# EAGLE board SL869-GL868-Rx (EAGLE 6.5.0)
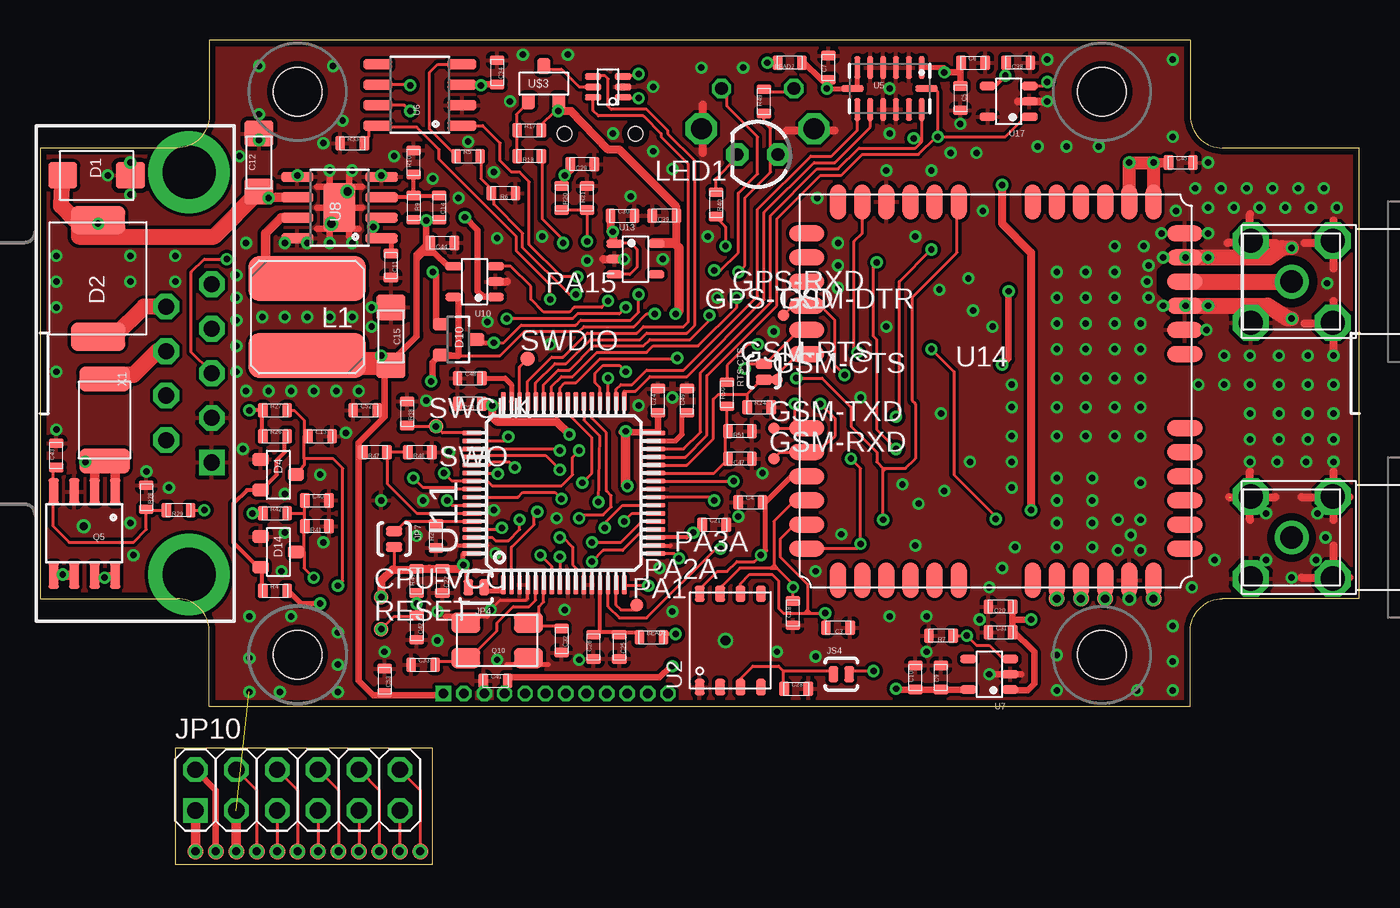
[diagram p1: board, top side]
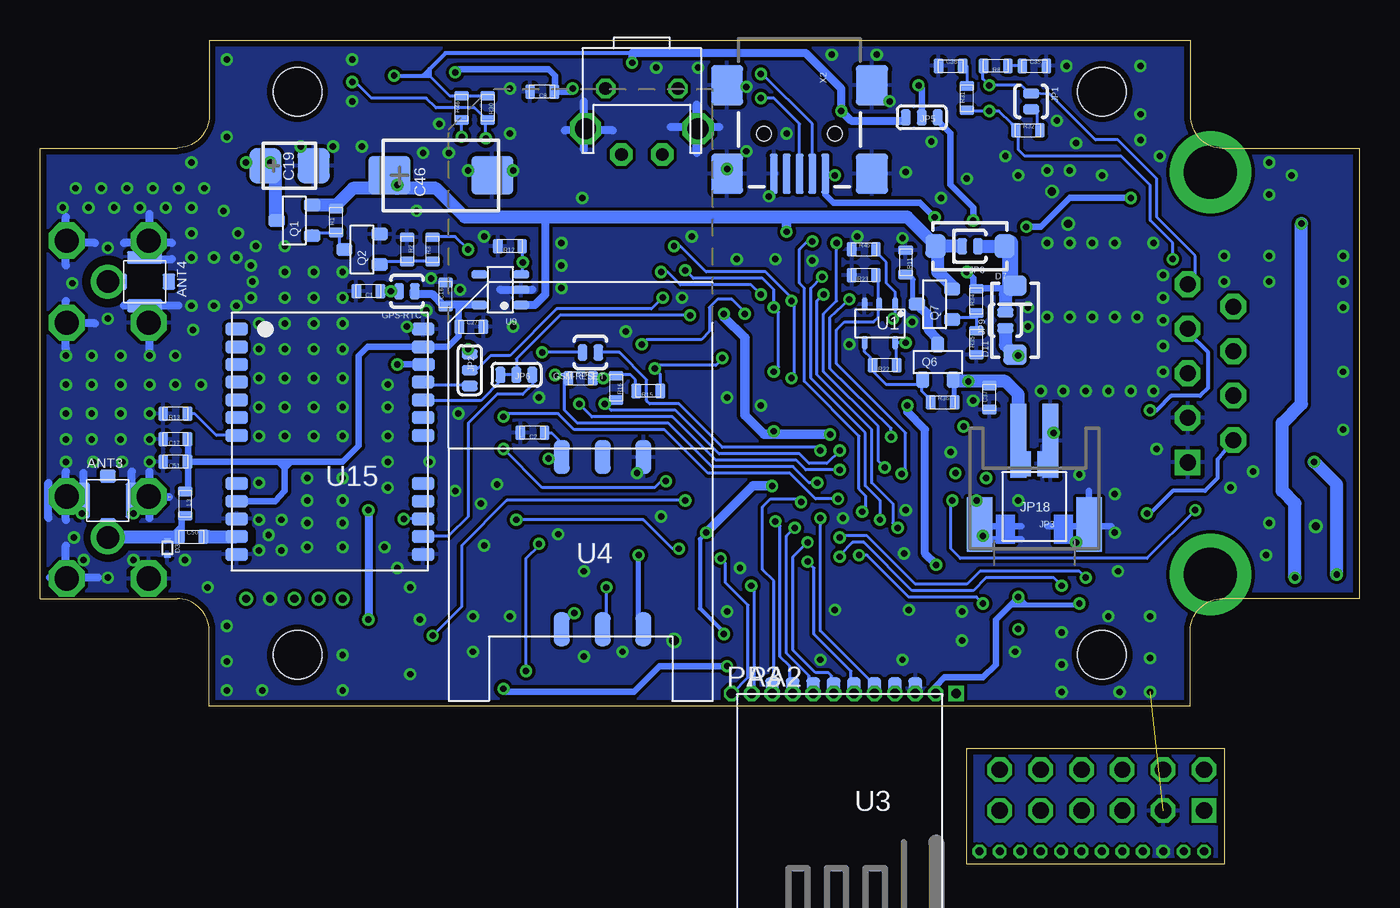
[diagram p2: board, bottom side, seen from below]

Size 82 x 51.2 mm. Coordinates in mm from the lower left corner, seen from the top.
Outline: 8.4,7.2 8.4,0 24.4,0 24.4,7.2 8.4,7.2
Copper layers (1*16): Top 0.0356mm / dielectric 1.5011mm / Bottom 0.0356mm
Design rules "OSHPark *": minimum track width 6mil, minimum drill 13mil, track to track 6mil, track to pad 6mil, pad to pad 6mil, via to via 6mil, smd to smd 6mil, copper to edge 15mil, drill to drill 6mil, minimum pad ring 7mil, minimum via ring 7mil, stop-mask expansion 3mil, vias tented up to drill 0.4mm, thermal gap 10mil
tRestrict: area 76.5,34.9 to 79.1,37.5; area 76.6,19.1 to 79,21.5; 6 lines
bRestrict: area 76.5,34.9 to 79.1,37.5; area 76.6,19.1 to 79,21.5; 6 lines

## Footprints (pad centres in the part's own frame; a part is rotated, then mirrored left to right if it is on the bottom)
SMA-002 = drill 1.4 pad 2: A 0,0 | drill 1.5 pad 2 octagon: GND@1 -2.55,2.55; GND@2 2.55,2.55; GND@3 2.55,-2.55; GND@4 -2.55,-2.55
MM9329 = smd 1 x 0.8: 1 0,-1.5; P$3 0,1.5 | smd 0.8 x 2.2: 2 -1.5,0; 2@1 1.5,0
0603 = smd 0.6 x 0.9: 1 -0.75,0; 2 0.75,0
1206 = smd 1.6 x 1.8: 1 -1.8,0; 2 1.8,0
CT3528 = smd 2 x 2.2: + -1.5,0; - 1.5,0
CT7343 = smd 2.6 x 2.4: + -3.2,0; - 3.2,0
TP09R = smd 0.9 x 0.9: TP 0,0
SMA = smd 1.8 x 1.65: P$1 2.1,0; P$2 -2.1,0
SMC = smd 1.75 x 3.4: P$1 3.625,0; P$2 -3.625,0
SOD-923 = smd 0.3 x 0.4: 1 -0.45,0; 2 0.45,0
SOT-23 = smd 0.8 x 1: 1 -0.95,-1.1; 2 0.95,-1.1; 3 0,1.1
SMA-DIODE = smd 1.27 x 1.47: A -2.15,0; C 2.15,0
SOT23 = smd 0.8 x 1: 1 -0.95,-1.1; 2 0.95,-1.1; 3 0,1.1
PAD.1X1 = smd 1 x 1: P$1 0,0
1812 = smd 1.58 x 3.15: 1 -2.55,0; 2 2.55,0
PAD.03X.03 = smd 0.762 x 0.762: P$1 0,0
SJ_2S-NO = smd 0.6 x 1: 1 -0.49,0; 2 0.49,0
TP07R = smd 0.7 x 0.7: TP 0,0
SJ_3 = smd 0.635 x 1: 1 -0.99,0; 2 0,0; 3 0.99,0
S2B-PH = smd 1 x 4.6: 1 -1,-3.7; 2 1,-3.7 | smd 1.6 x 3.4: NC1 -3.4,1.5; NC2 3.4,1.5
2X06 = drill 1.016 square: 1 -6.35,-1.27 | drill 1.016 octagon: 2 -6.35,1.27; 3 -3.81,-1.27; 4 -3.81,1.27; 5 -1.27,-1.27; 6 -1.27,1.27; 7 1.27,-1.27; 8 1.27,1.27; 9 3.81,-1.27; 10 3.81,1.27; 11 6.35,-1.27; 12 6.35,1.27
CI1102M1H = smd 0.6 x 1.55: 1 -0.5,4.775; 2 0.5,4.775
CDRH6D38NP = smd 7.3 x 2.8: P$1 0,-2.4; P$2 0,2.4
LED3MM = drill 0.8 pad 1.4 octagon: A -1.27,0; K 1.27,0
TP08R = smd 0.8 x 0.8: TP 0,0
SO08 = smd 0.65 x 1.7: 1 -1.905,-2.6; 2 -0.635,-2.6; 3 0.635,-2.6; 4 1.905,-2.6; 5 1.905,2.6; 6 0.635,2.6; 7 -0.635,2.6; 8 -1.905,2.6
KX-9A = smd 1.8 x 1.25: 1 -1.95,-1.1; 2 1.95,-1.1; 3 1.95,1.1; 4 -1.95,1.1
SWT-7 = drill 0.8 octagon: 1 -2.25,0; 2 2.25,0 | drill 1.3 octagon: G@1 -3.5,2.5; G@2 3.5,2.5
SOT-753 = smd 0.4 x 0.8: 1 -0.95,-1.2; 2 0.05,-1.2; 3 0.95,-1.2; 4 0.95,1.2; 5 -0.95,1.2
MFF2 = smd 1 x 0.6: 1 -2.9,1.905; 2 -2.9,0.635; 3 -2.9,-0.635; 4 -2.9,-1.905; 5 2.9,-1.905; 6 2.9,-0.635; 7 2.9,0.635; 8 2.9,1.905
RFM70S = smd 0.85 x 1.4: CE -2.16,-2; CSN -0.89,-2; GND -4.7,-2; IRQ 4.19,-2; MISO 2.92,-2; MOSI 1.65,-2; SCK 0.38,-2; VDD -3.43,-2
6393699-1 = smd 2.1 x 1: 1 0.75,-2.6; 2 0.75,-0.06; 3 0.75,2.48; 4 11.45,-2.6; 5 11.45,-0.06; 6 11.45,2.48
LGA14 = smd 0.4 x 1.4: 1 2,1.3; 2 1.2,1.3; 3 0.4,1.3; 4 -0.4,1.3; 5 -1.2,1.3; 6 -2,1.3; 8 -2,-1.3; 9 -1.2,-1.3; 10 -0.4,-1.3; 11 0.4,-1.3; 12 1.2,-1.3; 13 2,-1.3 | smd 1.4 x 0.4: 7 -2.3,0; 14 2.3,0
SO08' = smd 0.6 x 1.8: 1 -1.905,-2.616; 2 -0.635,-2.616; 3 0.635,-2.616; 4 1.905,-2.616; 5 1.905,2.616; 6 0.635,2.616; 7 -0.635,2.616; 8 -1.905,2.616
SOT23-5 = smd 0.5 x 1: 1 -0.95,-1.3; 2 0,-1.3; 3 0.95,-1.3; 4 0.95,1.3; 5 -0.95,1.3
SO08-EPAD = smd 0.6 x 2: 1 -1.905,-2.616; 2 -0.635,-2.616; 3 0.635,-2.616; 4 1.905,-2.616; 5 1.905,2.616; 6 0.635,2.616; 7 -0.635,2.616 | smd 0.61 x 2: 8 -1.905,2.616 | smd 3 x 2: EPAD 0,0
TQFP64 = smd 1.2 x 0.3: 1 -5.7,3.75; 2 -5.7,3.25; 3 -5.7,2.75; 4 -5.7,2.25; 5 -5.7,1.75; 6 -5.7,1.25; 7 -5.7,0.75; 8 -5.7,0.25; 9 -5.7,-0.25; 10 -5.7,-0.75; 11 -5.7,-1.25; 12 -5.7,-1.75; 13 -5.7,-2.25; 14 -5.7,-2.75; 15 -5.7,-3.25; 16 -5.7,-3.75; 33 5.7,-3.75; 34 5.7,-3.25; 35 5.7,-2.75; 36 5.7,-2.25; 37 5.7,-1.75; 38 5.7,-1.25; 39 5.7,-0.75; 40 5.7,-0.25; 41 5.7,0.25; 42 5.7,0.75; 43 5.7,1.25; 44 5.7,1.75; 45 5.7,2.25; 46 5.7,2.75; 47 5.7,3.25; 48 5.7,3.75 | smd 0.3 x 1.2: 17 -3.75,-5.7; 18 -3.25,-5.7; 19 -2.75,-5.7; 20 -2.25,-5.7; 21 -1.75,-5.7; 22 -1.25,-5.7; 23 -0.75,-5.7; 24 -0.25,-5.7; 25 0.25,-5.7; 26 0.75,-5.7; 27 1.25,-5.7; 28 1.75,-5.7; 29 2.25,-5.7; 30 2.75,-5.7; 31 3.25,-5.7; 32 3.75,-5.7; 49 3.75,5.7; 50 3.25,5.7; 51 2.75,5.7; 52 2.25,5.7; 53 1.75,5.7; 54 1.25,5.7; 55 0.75,5.7; 56 0.25,5.7; 57 -0.25,5.7; 58 -0.75,5.7; 59 -1.25,5.7; 60 -1.75,5.7; 61 -2.25,5.7; 62 -2.75,5.7; 63 -3.25,5.7; 64 -3.75,5.7
GL865/8-DUAL = smd 2.2 x 1: 1 -11.75,9.8; 2 -11.75,8.3; 3 -11.75,6.8; 4 -11.75,5.3; 5 -11.75,3.8; 6 -11.75,2.3; 7 -11.75,-2.3; 8 -11.75,-3.8; 9 -11.75,-5.3; 10 -11.75,-6.8; 11 -11.75,-8.3; 12 -11.75,-9.8; 25 11.75,-9.8; 26 11.75,-8.3; 27 11.75,-6.8; 28 11.75,-5.3; 29 11.75,-3.8; 30 11.75,-2.3; 31 11.75,2.3; 32 11.75,3.8; 33 11.75,5.3; 34 11.75,6.8; 35 11.75,8.3; 36 11.75,9.8 | smd 1 x 2.2: 13 -9.8,-11.75; 14 -8.3,-11.75; 15 -6.8,-11.75; 16 -5.3,-11.75; 17 -3.8,-11.75; 18 -2.3,-11.75; 19 2.3,-11.75; 20 3.8,-11.75; 21 5.3,-11.75; 22 6.8,-11.75; 23 8.3,-11.75; 24 9.8,-11.75; 37 9.8,11.75; 38 8.3,11.75; 39 6.8,11.75; 40 5.3,11.75; 41 3.8,11.75; 42 2.3,11.75; 43 -2.3,11.75; 44 -3.8,11.75; 45 -5.3,11.75; 46 -6.8,11.75; 47 -8.3,11.75; 48 -9.8,11.75
SL868/9 = smd 1.4 x 0.8: 1 5.8,-7; 2 5.8,-5.9; 3 5.8,-4.8; 4 5.8,-3.7; 5 5.8,-2.6; 6 5.8,-1.5; 7 5.8,-0.4; 8 5.8,2.6; 9 5.8,3.7; 10 5.8,4.8; 11 5.8,5.9; 12 5.8,7; 13 -5.8,7; 14 -5.8,5.9; 15 -5.8,4.8; 16 -5.8,3.7; 17 -5.8,2.6; 18 -5.8,-0.4; 19 -5.8,-1.5; 20 -5.8,-2.6; 21 -5.8,-3.7; 22 -5.83,-4.8; 23 -5.8,-5.9; 24 -5.8,-7
G403 = hole 3: 66,38.2; 66,3.2; 16,38.2; 16,3.2
SOT323-6 = smd 0.4 x 1.05: 1 -0.65,-0.925; 2 0,-0.925; 3 0.65,-0.925; 4 0.65,0.925; 5 0,0.925; 6 -0.65,0.925
DB9 = drill 1 pad 1.6 square: 1 -5.54,-1.42 | drill 1 pad 1.6 octagon: 2 -2.77,-1.42; 3 0,-1.42; 4 2.77,-1.42; 5 5.54,-1.42; 6 -4.15,1.42; 7 -1.38,1.42; 8 1.38,1.42; 9 4.15,1.42 | drill 3.302 pad 5.08: G1 -12.5,0; G2 12.5,0
USB-MINIB = smd 2.5 x 0.5: D+ 2.5,0; D- 2.5,0.8; GND 2.5,-1.6; ID 2.5,-0.8; VBUS 2.5,1.6 | smd 2.5 x 2: GND@1 -3,-4.5; GND@2 -3,4.5; GND@3 2.5,4.5; GND@4 2.5,-4.5 | hole 0.9: 0,2.2; 0,-2.2

## Placement (x,y rotation side)
ANT1  SMA-002  [SMA-002]  77.8,20.3 90 top
ANT2  SMA-002  [SMA-002]  77.8,36.2 90 top
ANT3  SMA-002  [MM9329]  77.8,22.6 0 bottom
ANT4  IPF  [MM9329]  75.5,36.2 270 bottom
BEAD1  FB600  [0603]  38,14.1 0 top
BEAD2  FB600  [0603]  46.6,49.8 180 top
C1  2.2u  [0603]  61.6,35.6 180 bottom
C2  22p  [0603]  51.4,26.8 180 bottom
C3  22p  [0603]  49.6,14.7 180 top
C4  10n  [0603]  44.15,22.5 0 top
C5  10u  [0603]  57.2,47.6 270 top
C6  0.1u  [0603]  58,49.8 0 top
C7  10u  [0603]  49,49.5 90 top
C8  0.1u  [0603]  50.8,48 180 bottom
C9  4.7u  [0603]  56,11.6 90 top
C10  0.1u  [0603]  54.4,11.6 90 top
C11  0.1u/50  [0603]  21.8,37.2 270 top
C12  10u/50  [1206]  13.6,43.6 90 top
C13  0.1u  [0603]  17.4,26.6 0 top
C14  4n7  [0603]  24.8,40.8 270 top
C15  22x10  [1206]  21.8,32.8 270 top
C16  10u  [0603]  56.8,35.4 90 bottom
C17  0.1u  [0603]  73.6,26.4 180 bottom
C18  22p  [0603]  46.8,15.6 90 top
C19  22x6.3  [CT3528]  66.5,43.4 0 bottom
C20  4.7u  [0603]  59.7,16 180 top
C21  0.1u  [0603]  41.9,21.1 0 top
C22  0.1u  [0603]  25,17.6 270 top
C23  0.1u  [0603]  26.7,28.6 180 top
C24  0.1u  [0603]  38.4,28.8 90 top
C25  2.2u  [0603]  36,13.5 270 top
C26  0.1u  [0603]  34.4,13.5 90 top
C27  0.1u  [0603]  55.2,33.4 0 bottom
C28  22p  [0603]  47,10.9 0 top
C29  4.7u  [0603]  33.7,43.5 180 top
C30  4.7u  [0603]  36.2,40.3 0 top
C31  0.1u  [0603]  59.7,14.4 0 top
C32  15p  [0603]  32.4,13.9 270 top
C33  15p  [0603]  23.8,12.4 0 top
C34  4.7u  [0603]  28.4,49.2 270 top
C35  560p  [0603]  20.2,49.6 0 bottom
C36  560p  [0603]  25.4,49.6 0 bottom
C37  4.7u  [0603]  23,29 90 bottom
C38  0.1u  [0603]  60.8,49.8 180 top
C39  4.7u  [0603]  38.8,40.3 180 top
C40  0.1u  [0603]  17.2,22.6 0 top
C41  0.1u  [0603]  28.3,11.4 0 top
C42  0.1u  [0603]  23.4,14.7 270 top
C43  0.1u  [0603]  1,25.4 90 top
C44  0.1u  [0603]  25,38.6 180 top
C45  0.1u  [0603]  70.9,43.6 0 top
C46  220x6.3  [CT7343]  57.1,42.8 0 bottom
C47  0.1u  [0603]  43.5,25.2 180 top
C48  2u2  [0603]  26.7,30.2 0 top
C49  2u2  [0603]  40.2,28.8 90 top
C50  27p  [0603]  72.6,20.35 0 bottom
C51  27p  [0603]  73.6,25 180 bottom
C52  0.1u  [0603]  20.2,28.2 0 top
C53  0.1u  [0603]  21.4,11.4 270 top
CPU-VCC  TPTP09R  [TP09R]  21.2,16.6 0 top
D1  SMAJ24CA  [SMA]  3.5,42.8 180 top
D2  MBRS360T3G  [SMC]  3.6,36.4 90 top
D3  ESD9R3.3S  [SOD-923]  74.1,19.65 270 bottom
D4  BAV99  [SOT-23]  14.8,24.2 270 top
D7  SS14/SS24  [SMA-DIODE]  24.2,38.4 180 bottom
D10  BAT54C  [SOT23]  26,32.6 270 top
D11  SS24  [SMA-DIODE]  21.4,33.8 90 bottom
D14  BAV99  [SOT-23]  14.8,19.4 270 top
EX1  [PAD.1X1]  9.65,0.79 0 top
EX2  [PAD.1X1]  10.92,0.79 0 top
EX3  [PAD.1X1]  12.19,0.79 0 top
EX4  [PAD.1X1]  13.46,0.79 0 top
EX5  [PAD.1X1]  14.73,0.79 0 top
EX6  [PAD.1X1]  16,0.79 0 top
EX7  [PAD.1X1]  17.27,0.79 0 top
EX8  [PAD.1X1]  18.54,0.79 0 top
EX9  [PAD.1X1]  19.81,0.79 0 top
EX10  [PAD.1X1]  21.08,0.79 0 top
EX11  [PAD.1X1]  22.35,0.79 0 top
EX12  [PAD.1X1]  23.62,0.79 0 top
F1  1.5A  [1812]  4,27.6 90 top
GND  [PAD.03X.03]  21.2,22.6 0 top
GPS-RTC  GPS-RTC  [SJ_2S-NO]  59.2,35.6 180 bottom
GPS-RXD  TPTP07R  [TP07R]  43.3,35.2 0 top
GPS-TXD  TPTP07R  [TP07R]  41.6,34.1 0 top
GSM-CTS  TPTP07R  [TP07R]  45.8,30.1 0 top
GSM-DTR  TPTP07R  [TP07R]  46.2,34.1 0 top
GSM-RESET  RTS-CTS  [SJ_2S-NO]  47.8,31.8 180 bottom
GSM-RTS  TPTP07R  [TP07R]  43.8,30.8 0 top
GSM-RXD  TPTP07R  [TP07R]  45.6,25.2 0 top
GSM-TXD  TPTP07R  [TP07R]  45.6,27.1 0 top
JP1  CAN-TERM  [SJ_2S-NO]  20.4,47.4 270 bottom
JP2  RX-SEL  [SJ_3]  55.3,30.7 270 bottom
JP3  BAT2  [S2B-PH]  20.2,22.6 180 bottom
JP4  VBAT  [SJ_2S-NO]  27.1,17.2 180 top
JP5  CANPWR-SEL  [SJ_3]  27.2,46.4 180 bottom
JP6  TX-SEL  [SJ_3]  52.4,30.4 180 bottom
JP7  BOOT0  [SJ_2S-NO]  22,20.2 270 top
JP8  [SJ_2S-NO]  24.2,38.4 180 bottom
JP9  [SJ_2S-NO]  22,33.8 90 bottom
JP10  [2X06]  16,4.6 0 top
JP18  BAT1  [CI1102M1H]  20.2,20.1 0 bottom
JS4  USE-SOC  [SJ_2S-NO]  49.8,11.8 0 top
L1  3R3  [CDRH6D38NP]  16.6,34 180 top
L3  27nH  [0603]  73,22.4 270 bottom
LED1  STATUS  [LED3MM]  44.6,44.1 180 top
MICN  [PAD.1X1]  66.2,16.5 0 top
MICP  [PAD.1X1]  69.2,16.5 0 top
PA1  TPTP08R  [TP08R]  37.1,16.1 0 top
PA2  TPTP08R  [TP08R]  37.76,10.6 0 bottom
PA2A  TPTP07R  [TP07R]  37.8,17.3 0 top
PA3  TPTP08R  [TP08R]  39.03,10.6 0 bottom
PA3A  TPTP07R  [TP07R]  39.7,19 0 top
PA15  TPTP07R  [TP07R]  31.7,35.1 0 top
PB4  TEST-POINT3  [PAD.03X.03]  23.2,24 0 top
Q1  IRLML6402  [SOT-23]  66.2,40 90 bottom
Q2  BC847/BSS138  [SOT-23]  62,38.2 90 bottom
Q5  IRF7353D2  [SO08]  2.75,20.55 180 top
Q6  IRLML6401  [SOT-23]  26.2,31.2 0 bottom
Q7  IRLML6401  [SOT-23]  26.4,34.8 90 bottom
Q10  8MHz  [KX-9A]  28.4,13.9 180 top
R1  100K  [0603]  63.6,40 90 bottom
R2  22K  [0603]  59.2,38.2 270 bottom
R3  2K2  [0603]  57.6,38.2 90 bottom
R4  10  [0603]  14.6,17 0 top
R5  1K  [0603]  26.6,44 0 top
R6  2K2  [0603]  28.8,41.7 180 top
R7  22K  [0603]  56,14.2 180 top
R8  100  [0603]  22.6,49.6 180 bottom
R9  82.5K  [0603]  23.2,40.8 270 top
R10  20K  [0603]  23.2,43.6 90 top
R11  1M  [0603]  28.2,37.4 270 bottom
R12  22K  [0603]  52.8,38.4 180 bottom
R13  DNP/100K  [0603]  73.6,28 180 bottom
R14  47K  [0603]  48.4,30.2 0 bottom
R15  47K  [0603]  44.2,29.4 180 bottom
R16  47K  [0603]  46.2,29.6 270 bottom
R17  47K  [0603]  30.4,45.6 0 top
R18  10K  [0603]  30.4,44 180 top
R20  22K  [0603]  32.4,41.4 270 top
R21  22K  [0603]  34,41.4 90 top
R22  100K  [0603]  29.5,31 180 bottom
R23  100K  [0603]  30.8,36.6 180 bottom
R24  100K  [0603]  44.7,28.4 0 top
R25  100K  [0603]  24.6,20.4 90 top
R26  100K  [0603]  14.6,26.6 0 top
R27  100K  [0603]  14.6,28.2 0 top
R28  22K  [0603]  6.6,22.8 270 top
R29  470  [0603]  8.6,22 180 top
R30  10K  [0603]  54.2,47 270 bottom
R31  100  [0603]  24.4,47.6 90 bottom
R32  120  [0603]  20.6,45.6 0 bottom
R33  10K/4K7  [0603]  19.4,44.8 0 top
R34  10K  [0603]  23.8,35 90 bottom
R35  100K  [0603]  23.8,32.4 90 bottom
R36  100K  [0603]  25.9,28.7 0 bottom
R38  100K  [0603]  22.8,28 270 top
R40  470  [0603]  42,41 270 top
R41  22K  [0603]  17.2,21 180 top
R42  100K  [0603]  14.6,21.8 0 top
R43  22K  [0603]  23.4,17.6 90 top
R45  100K  [0603]  30.8,38.2 0 bottom
R46  10K  [0603]  55.8,47 90 bottom
R47  100K  [0603]  20.8,25.6 180 top
R48  100K  [0603]  23.6,25.6 180 top
R49  10K  [0603]  45,47.4 90 top
R50  100K  [0603]  42.7,29.2 90 top
R51  100K  [0603]  43.5,26.9 180 top
RESET  TPTP09R  [TP09R]  21.2,14.6 0 top
RTS-CTS  RTS-CTS  [SJ_2S-NO]  45,30.6 90 top
SPKM  [PAD.1X1]  63.2,16.5 0 top
SPKP  [PAD.1X1]  64.7,16.5 0 top
SW1  SWT7  [SWT-7]  44.6,48.2 180 bottom
SWCLK  TPTP09R  [TP09R]  24.6,27.2 0 top
SWDIO  TPTP09R  [TP09R]  30.3,31.4 0 top
SWO  TPTP07R  [TP07R]  25.1,24.3 0 top
U1  74LVC1G02GV  [SOT-753]  29.8,33.6 180 bottom
U2  SIMHOLDER-MFF2  [MFF2]  42.9,13.9 90 top
U3  RFM70S  [RFM70S]  32.3,8.9 180 bottom
U4  SIMHOLDER-6393699  [6393699-1]  47.1,13.85 90 bottom
U5  MMA7455L  [LGA14]  52.8,48.2 0 top
U6  MCP2551  [SO08']  23.6,47.8 90 top
U7  AAT3221IGV-3.3-T1  [SOT23-5]  59,11.8 90 top
U8  ST1S10-SO8PAD  [SO08-EPAD]  18.6,40.8 90 top
U9  LP3985IM5-3.0  [SOT23-5]  53.4,35.7 90 bottom
U10  MAX1555  [SOT23-5]  27,36.2 90 top
U11  STM32F103RBT6  [TQFP64]  32.55,23.05 90 top
U13  MP8802DJ-3.3-LF  [SOT23-5]  37,37.6 270 top
U14  GL865/8-DUAL  [GL865/8-DUAL]  59.4,29.4 0 top
U15  SL868/9  [SL868/9]  64,26.25 180 bottom
U17  24LC16B-I/OT  [SOT23-5]  60.2,47.4 90 top
U$1  [G403]  0,9.8 0 top
U$3  PDTA114ET  [SOT-23]  31.3,48.5 0 top
U$4  USBUF02W6  [SOT323-6]  35.3,48.3 90 top
X1  DB-9  [DB9]  9.25,30.5 90 top
X2  USB-SMD  [USB-MINIB]  34.8,45.4 270 bottom

## Tracks (layer width: path | path; a pad name or v marks a point on that pad's centre or on a via)
+5V  (via drill 0.4)
  Top 0.2: v32.6,42.8 32.4,42.6 R20.1
  Top 0.4: U10.1 27.55,35.25 27.2,35.6 27.2,39.4 v26.4,40.2
  Top 0.5: C29.2 32.95,43.15 v32.6,42.8
  Bottom 0.4: 33.2,42.8 v32.6,42.8 | 33.2,42.8 33.2,41.6 32.7,41.1 27.3,41.1 v26.4,40.2 | 33.2,42.8 X2.VBUS
+12-IN
  Top 0.8: 3.62,32.62 3.6,32.6 D2.P$2
  Top 1: X1.9 6.45,34.65 4.6,32.8 3.62,32.8 D2.P$2
+12V  (via drill 0.4)
  Top 0.3: C11.1 21.8,38.89 U8.1
  Top 0.4: U8.2 20.7,40.16 v20.7,39.6 20.7,38.89 U8.1
  Top 0.5: Q5.7 3.45,17.75 v4,17.8 4.55,17.95 Q5.8 | v3.6,39.8 D2.P$1
  Top 0.6: U8.6 14.63,41.44 v14.2,41.4
  Top 0.65: C12.1 v14.2,41.4
  Top 1: C12.1 10.8,39 2.4,39 2.4,39.67 3.65,39.67 D2.P$1 2.17,40.03 1.3,40.9 D1.P$1
  Bottom 0.4: v14.2,41.4 18,41.4 19.8,39.6 v20.7,39.6
  Bottom 0.8: v4,17.8 4,22.4 4.8,23.2 4.8,27.4 3.6,28.6 v3.6,39.8
A1  (via drill 0.4)
  Top 0.25: v13.2,21.8 R42.1
  Bottom 0.25: X1.6 8.8,25.13 8.8,24 9.6,23.2 11.6,23.2 13,21.8 v13.2,21.8
ACC-VCC  (via drill 0.4)
  Top 0.3: U5.6 50.8,48.2 U5.7 49,48.2 | U5.1 56.2,49.5 v56.2,49.2 | 48.84,48.7 C7.1 49,48.2 | 49,48.2 v48.9,48.2
  Top 0.4: 48.84,48.7 48.6,48.7 47.4,49.9 47.4,50 BEAD2.1 | C6.1 57.2,50 57.2,49.2 | 57.2,49.2 C5.1 | v56.2,49.2 57.2,49.2
  Bottom 0.4: v56.2,49.2 56,49.4 50.4,49.4 50,49 50,48.05 C8.1 49.1,48 v48.9,48.2
CANH  (via drill 0.4)
  Top 0.2: U6.7 22.64,47.17 v23,46.8 | X1.3 10.55,30.65 9.4,31.8 9.4,36.8 10.2,37.6 v11.6,37.6
  Bottom 0.2: v11.6,37.6 11.6,38.6 13,40 13,42.2 14.8,44 20.8,44 21.2,44.4 21.2,45.47 R32.1 21.6,46 22.4,46.8 v23,46.8 23.88,46.8 R31.1
  Bottom 0.25: R32.1 21.48,45.45
CANL  (via drill 0.4)
  Top 0.2: U6.6 22.96,48.44 v23,48.4
  Bottom 0.2: X1.5 10.59,36.19 10.2,36.6 10.2,37.8 12.6,40.2 12.6,42.6 15,45 16.4,45 19.25,47.85 JP1.1 | 20.41,47.81 21,48.4 v23,48.4 23.4,48.8 23.4,49.54 R8.2
  Bottom 0.25: JP1.1 20.41,47.83 20.41,47.81 20.4,47.8
CPU-VBAT
  Top 0.2: 28.8,17 U11.1
  Top 0.3: 28.8,17 27.55,17 JP4.1
CPU-VCC  (via drill 0.4, 0.6)
  Top 0.2: v60,49 60.05,49.05 | JP7.2 22,18.4 21.9,18.3 | R17.2 31.15,45.95 32,46.8 v32.2,46.8
  Top 0.25: U11.19 40.2,20.3 40.5,20.6 v40.6,20.6 | BEAD1.2 38.96,14.26 38.8,14.3 v39.5,14.3 | 26.3,19.3 U11.64 | U11.48 28.8,28.6 28.1,28.6 v28.1,28.5 | U17.4 59.35,48.35 v60,49 | 60.05,49.05 C38.2
  Top 0.3: v40.6,20.6 40.8,20.6 C21.1 | v26.3,18.6 26.3,19.3 | v45.2,49.8 BEAD2.2 | R4.2 15.4,17 16.2,16.2 v17.4,16.2 | 23.34,18.3 R43.2 | JP4.2 26.65,17.35 26.5,17.5 26.5,18.6 v26.3,18.6 | v26.3,18.6 26.2,18.6 | U11.32 38.1,26.8 38.4,26.85
  Top 0.4: v36.4,26.9 36.15,26.85 38.4,26.85 C24.1
  Top 0.5: 28.1,28.6 C23.1 | 38.1,38.6 U13.5 | U13.5 38.16,38.55 | v28.1,28.5 28.1,27.8 28.4,27.5 32.1,27.5 v32.9,26.7 | 23.34,18.3 21.9,18.3 21.2,17.6 CPU-VCC.TP | R43.2 24.2,18.36 C22.1 26,18.35 26.2,18.6 26.26,18.56 v26.3,18.6 | U$3.2 32.25,46.65 v32.2,46.8 33,46.8 35.3,44.4 36,44.4 39.55,40.85 C39.1 39.55,38.55 U13.5
  Top 0.6: v36.4,26.9 36.4,23.5 v36.5,23.5 | 38.1,38.6 39.4,38.6 39.7,38.3 39.7,34.4 v39.5,34.2
  Bottom 0.2: R30.1 R46.2 56.56,47.76 57.8,49
  Bottom 0.25: v39.5,14.3 39.6,14.5 41,15.9 41,20.2 v40.6,20.6 | 45.2,50.4 56.8,50.4 57.8,49.4 | 57.8,49.4 57.8,49 58.2,49 | v60,49 58.2,49 | 57.8,49.4 58.2,49
  Bottom 0.3: v17.4,16.2 17.5,16.1 20.7,16.1 | 20.7,16.1 CPU-VCC.TP | 20.7,16.1 21.7,16.1
  Bottom 0.4: 28.2,46.2 28.2,46.29 JP5.3 | CPU-VCC.TP 21.7,16.1 22.6,15.2 22.6,12.4 23.4,11.6 25.8,11.6 26.33,11.07 v26.33,10.6
  Bottom 0.5: v45.2,49.8 45.2,50.4 34.4,50.4 32.2,48.2 v32.2,46.8 31.6,46.2 28.39,46.2 JP5.3 | v28.1,28.5 28.1,28.1 27,27 27,19.3 v26.3,18.6
  Bottom 0.6: v36.5,23.5 37.7,23.5 v40.6,20.6 | 36.4,26.7 37,26.7 38.2,27.9 38.2,32.7 39.5,34 v39.5,34.2 | v32.9,26.7 36.4,26.7 | 36.4,26.7 v36.4,26.9
  other vias: 21.2,16.6
D1  (via drill 0.4)
  Top 0.25: v13,28.2 R27.1 13.8,28.15 13.8,26.8 R26.1
  Bottom 0.25: X1.4 10.62,33.02 9.4,31.8 9.4,29.6 9.9,29.1 11.7,29.1 12.6,28.2 v13,28.2
D+
  Top 0.2: U11.45 30.3,30 31.8,31.5 32.5,31.5 34,33 37.1,33 37.5,33.4 40,33.4 40.3,33.7 40.3,43.5 38.6,45.2 38.6,45.4 37.5,46.5 34.7,46.5 34.38,46.83 U$4.6
D-
  Top 0.2: U11.44 30.8,29.9 32,31.1 32.7,31.1 34.2,32.6 37.3,32.6 37.7,33 40.2,33 40.7,33.5 40.7,43.7 39,45.4 39,45.6 37.7,46.9 35.5,46.9 35.3,47.1 35.3,48.8 35.1,49 34.38,49 U$4.4
GND  (via drill 0.4, 0.5, 0.6)  (2 unrouted)
  Top 0.2: 30.3,17.4 30.3,16.5 30.2,16.4 28.6,16.4 v28,15.8
  Top 0.25: 37.4,19.8 39.2,19.8 | 27.8,19.8 25.9,19.8
  Top 0.3: 31.6,12.4 29,12.4 | 27.8,15.4 25.2,15.4
  Top 0.4: 59.2,11.8 61,11.8 | 17.2,40.8 20,40.8 | 18,39 18,42.8 | 19.2,39 19.2,42.8 | 17.2,39.5 19.8,39.5 | 17.2,42.1 20,42.1
  Top 0.5: 28.2,36.2 29,36.2 | 35,37.6 v36.3,37.6 | 75.2,38.6 73.8,38.6 | 75.2,38.6 76.8,38.6 | 78.6,38.6 81.2,38.6 | 78.6,33.6 81.2,33.6 | 80.4,37 80.4,40 | 75.2,38.6 75.2,40.4 | 80.4,32 80.4,35 | 78.4,22.8 81.4,22.8 | 75.2,21.4 75.2,24.4 | 73.9,22.8 76.8,22.8 | 80.4,21.4 80.4,24.4 | 80.4,17 80.4,19.8 | 78.4,17.8 81.4,17.8 | 41.2,44.2 41.2,47.2 | 46.4,45.6 49.4,45.6 | 60.8,47.4 v62.6,47.4
  Top 0.6: JP10.3 EX3.P$1
  Top 0.9: 77.2,38.3 v77.8,38.3 | 77.6,33.9 v77.8,33.9
  Top 1: 71.1,37.7 76.4,37.7 77.2,38.3 | 71.6,34.7 76.3,34.7 77.6,33.9
  Bottom 0.2: 76.8,34.7 76.6,34.8 | 75.2,37.6 ANT4.2 | U4.4 44.9,25.3 v44.9,24.3
  Bottom 0.3: JP3.1 19.2,26.18 JP18.2
  Bottom 0.4: 16.8,19.6 16.8,23.2 | 15.4,21 19.4,21 | 23.4,21 23.4,22.4 | 23.4,21 v23.4,20.4 | 21,21 23.4,21 | 21,20.2 23.8,20.2 v23.8,22.6
  Bottom 0.5: 75.2,37.6 75.2,40.4 | 73.8,38.6 76.8,38.6 | 80.4,37.2 80.4,40.2 | 78.6,38.6 81.2,38.6 | 80.4,32 80.4,35 | 78.6,33.6 81.2,33.6 | 80.4,21.4 80.4,24.4 | 80.4,17.2 80.4,19.8 | 78.4,17.8 81.4,17.8 | 74,22.8 76.2,22.8 | 75.2,21.5 75.2,24.4 | ANT3.2 81.5,22.6 | 41.2,44.2 41.2,47.2 | 39.8,45.8 42.8,45.8 | 46.4,45.6 49.4,45.6 | 48.2,44.4 48.2,47.4 | 75.2,31.8 75.2,34.7 | 73.4,34.7 76.8,34.7 | 75.2,37.6 73.8,37.6 | 75.2,37.6 76.2,37.6 | 76.3,21.7 76.3,24.4 | 79.3,21.7 ANT3.2 | ANT3.2 79.3,24.3 | 53.4,35.7 51.4,35.7 | 81.5,21.5 81.5,22.6 | 81.5,22.6 81.5,23.7
  other vias: 17.6,44.8 13.6,45 12.4,44 4.2,42.8 5.6,43.6 5.6,41.6 19.1,41.8 18.1,39.8 12.2,33.8 13.8,34 15.2,34 16.6,34 5.6,36.2 8.4,36.2 5.6,37.8 1,37.8 1,34.6 1,30.6 1,27 2.7,21 12.8,38.6 13,15.4 5.8,19.2 18.2,49.6 13.6,49.6 16.6,38.6 16,42.8 21.2,42.8 70.4,50 5.6,21.2 52.8,15.4 59,11.8 54.6,22.4 27.6,10.6 14.2,29.4 19.8,29.4 19.4,38.6 36.7,41.5 20.6,34.6 32.6,15.8 33.5,12.7 24,28.8 19,26.8 63.2,13 65.4,21.2 63.2,22.6 68.4,21.4 68.4,23.7 68.4,26.6 66.8,28.4 63.2,26.6 53.6,23.6 62,44.6 72.6,39.2 72.5,33.2 80,36.1 76.2,21.8 79.9,20.3 77.8,17.8 70.4,10.8 58.4,15.2 55.1,15.4 37.2,28.5 32.1,21.5 24.4,42.6 22,44 30,50.3 28.4,38.9 72.6,37.7 72.6,34.7 48.2,12.9 38.5,18.4 31.2,39 18.4,29.4 28.2,22 17,29.4 15.6,29.4 17.4,24.2 17.6,20 21.2,22.6 12.8,29.4 42.1,35.2 41.1,49.5 38.7,37.6 41.5,39 48.3,41.4 42.6,13.9 69.7,39.2 74.2,40.8 52.8,48.2 57.2,46 62.6,50 72.6,43.6 70.4,45.2 63.8,44.6 68.4,30.2 73.6,31.6 75.2,31.6 77,31.6 78.8,31.6 80.4,31.6 75.2,25 76.9,25 78.7,25 80.4,25 75.2,26.4 75.2,28 79.4,21.8 79.3,18.9 76.2,18.9 73,18.9 67,21.4 24.7,13.9 28.4,12.7 65.8,44.6 80.6,40.8 79,40.8 77.4,40.8 75.8,40.8 18,34 19.4,34 12.2,30.6 12.2,36.6 12.2,35.2 12.2,32.2 27.8,33.7 63.2,10.8 67.7,16.5 68.2,10.8 70.4,14.8 70.4,12.6 15.2,20.6 39.3,15.7 52.8,45.4 39.3,43.2 18.5,14.4 18.5,12.4 13,12.8 15.6,15.4 18.5,10.7 13,10.7 68.8,36.2 63.2,24 25.4,25.6 38.1,44.3 54.4,19.8 39.3,29 59,17.2 71.6,17.2 43.4,21.6 48.2,18.2 49.6,37.2 51,29 65,35.2 52.6,43.1 63.2,36.8 63.2,30.2 63.2,33.6 63.2,35.2 60.4,23.4 63.2,32 63.2,28.4 66.8,26.6 66.8,30.2 68.4,28.4 6.6,24.4 26.6,44.9 38.1,48.3 52.6,33.4 29.2,47.4 32.8,50.3 35.6,45.4 56,28 65,33.6 65,32 65,30.2 65,28.4 65,26.6 55.4,43.1 56.6,44.2 58,34.4 65.4,24 65.4,19.7 67,19.5 68.4,19.5 63.2,19.7 63.2,21.2 60.6,19.7 68.4,32 66.8,32 73.6,29.8 75.2,29.8 68.9,35.2 14.9,10.7 65.4,22.6 70.6,40.6 72.6,40.8 21.4,13.2 45.8,13.2 28.2,43 18,38.6 19.4,43.1 18,43.1 15.2,38.6 1,36.2 8.4,37.8 55.1,13.2 57.7,36.4 55.9,35.7 49.8,20.5 58.2,44.2 43.7,49.5 54.4,39 58.6,40.6 68.9,37.2 65,36.8 66.8,33.6 68.4,33.6 66.8,35.2 66.8,36.8 66.8,38.4 68.6,38.4 71.2,34.7 71.2,37.7 69.8,34.7 69.8,37.7 79.8,42 78.2,42 76.6,42 75,42 73.4,42 71.8,42 20.6,33.4 56.2,23.2 77,29.8 77,28 77,26.4 59.2,33.4 60.4,25 60.4,26.6 60.4,28.4 57.8,25 72,29.8 78.8,29.8 80.4,29.8 80.4,28 78.8,28 78.8,26.4 80.4,26.4 12.6,25.8 8,23.4 31.7,32.3 15.2,23 15,18.2 28.3,19.3 45.6,33.1 59.8,18.4 26,41.4 18.8,46.2 13.6,46.6 49.6,35.8 49.6,38.6 24.7,15.7 67.8,20.45 60.4,29.8 12.19,0.79 34,37.5
  pour Top (isolate 0.2, rank 6): 10.55,9.8 10.55,16.55 0.05,16.55 0.05,44.45 9.05,44.45 10.6,46 10.55,51.2 71.45,51.2 71.45,45.55 72.6,44.4 81.95,44.45 81.95,16.55 72.8,16.6 71.45,15.25 71.45,9.8
  pour Bottom (isolate 0.2, rank 6): 10.55,9.8 10.55,16.55 0.05,16.55 0.05,44.45 9.05,44.45 10.6,46 10.55,51.2 71.45,51.2 71.45,45.55 72.6,44.4 81.95,44.45 81.95,16.55 72.8,16.6 71.45,15.25 71.45,9.8
  pour Bottom: 8.4,7.2 8.4,0 24.4,0 24.4,7.2
GPS-RX0  (via drill 0.4)
  Top 0.2: v55.4,32 56.8,30.6 56.8,24.2 59.4,21.6 v59.4,21.45
  Bottom 0.2: JP2.1 55.31,31.89 v55.4,32 | U15.15 v59.4,21.45
GPS-RX1
  Bottom 0.2: U15.21 57.85,29.95 57.8,29.8 55.4,29.8 55.4,29.81 JP2.3
GPS-TX0
  Bottom 0.2: JP6.1 51.41,29.79 52,29.2 53.6,29.2 55.4,27.4 55.4,21.6 56.6,20.4 58.6,20.4 58.65,20.35 U15.14
GPS-TX1
  Bottom 0.2: JP6.3 53.19,30.01 53.2,30 53.4,30 54.6,28.8 57.8,28.8 57.95,28.85 U15.20
GPS-VCC
  Bottom 0.4: U15.9 67.4,22.55 66.8,23.2 66.8,24.6 | C17.1 72.8,26.4 72.8,25 | C51.1 72.8,25 | 72.8,25 72.8,23.2 L3.1 | 72.8,25 67.2,25 | 67.2,25 66.8,25 | 66.8,25 66.8,24.6 | C16.1 56.8,34.75 | 56,34.75 56,33.4 C27.1 56,33.35 56,32.8 56.65,32.15 U15.23 61.65,32.15 62.2,31.6 62.2,26 63.2,25 66.4,25 | 66.8,25 66.4,25 | 66.8,24.6 66.4,25 | 66.8,24.6 67.2,25
  Bottom 0.5: U9.5 56,34.75 56.8,34.75 | C16.1 56.85,34.65 57.6,35.4 58.8,35.4 58.8,35.6 GPS-RTC.1
GSM-ANT
  Top 1: U14.34 ANT2.A
  Bottom 0.2: ANT2.A ANT4.1
GSM-RESET  (via drill 0.4)
  Top 0.2: v50.8,31.8 50.6,32 50.6,38.7 51.1,39.2 U14.47 51.1,41.2
  Bottom 0.2: GSM-RESET.2 48.3,31.75 GSM-RESET.2 v50.8,31.8
GSM-VCC  (via drill 0.4)
  Top 0.6: C45.1 v69.2,43.6
  Top 0.8: U14.37 v69.2,43.6 v67.7,43.6 U14.38
  Bottom 0.6: v67.7,43.6 C19.+
  Bottom 0.8: Q1.3 67.4,40 67.4,43.4 C19.+
GSM.MICN  (via drill 0.5)
  Top 0.2: MICN.P$1 U14.22
  other vias: 66.2,16.5
GSM.MICP  (via drill 0.5)
  Top 0.2: MICP.P$1 U14.24
  other vias: 69.2,16.5
GSM.SPKN  (via drill 0.5)
  Top 0.2: SPKM.P$1 U14.20
  other vias: 63.2,16.5
GSM.SPKP  (via drill 0.5)
  Top 0.2: SPKP.P$1 U14.21
  other vias: 64.7,16.5
N$1
  Bottom 0.2: 20,45.92 20,46.8
  Bottom 0.25: JP1.2 20.15,46.95 20,46.8 | R32.2 20,45.92
N$3
  Top 0.2: U$4.5 33.5,48.3 32.4,49.4 31.3,49.4 U$3.3
N$4  (via drill 0.4)
  Top 0.4: v59.8,31.05 60.2,31.4 v60.2,35.6
  Bottom 0.4: C1.1 v60.2,35.6 GPS-RTC.2 | v59.8,31.05 U15.22
N$5
  Bottom 0.2: 23.8,34 R35.2 | 25.35,33.85 25.2,34 23.8,34 | 23.8,34 R34.1
  Bottom 0.3: Q7.1 25.35,33.85
N$6  (via drill 0.4)
  Top 0.6: Q5.6 1.2,17.95 | 1.2,17.95 Q5.5 | 4.42,24.85 4.58,24.8 v2.8,25 3.38,25.02 Q5.2 | 4.42,24.85 F1.1 | 1.2,17.95 v1.4,18 | Q5.1 4.66,24.82 4.42,24.85
  Bottom 0.8: v1.4,18 1.4,23.6 v2.8,25
N$7
  Bottom 0.2: 63.8,39.2 65,39.2 | Q2.3 63.3,38.4 63.4,38.4 63.4,39.2 63.64,39.2 63.8,39.2 | R1.1 63.8,39.2
  Bottom 0.3: Q1.1 65.1,39.3 65,39.2 | R1.1 63.64,39.2
N$8
  Top 0.3: U11.31 39.5,26.3 39.9,26.7 39.9,28 C49.1
N$9
  Top 0.2: C48.2 27.4,30.2
  Top 0.3: U11.47 29.3,29.8 28.9,30.2 27.4,30.2
N$10
  Top 0.2: 46.2,12 45.9,12.3 44.3,12.3 43.44,11.44 U2.3 | C28.1 46.25,10.95 46.2,11 46.2,12 | JS4.1 49.2,11.4 49.2,12 46.2,12
N$11
  Bottom 0.2: C50.2 71.55,20.35
  Bottom 0.8: 71.55,20.35 U15.11
N$12
  Bottom 0.2: R3.1 R2.2 60.75,37.45 60.75,37.25 Q2.1
N$13
  Top 0.6: U8.7 14.96,40.16 14,39.2 14,37.4 15.6,37.4 L1.P$1
N$14
  Bottom 0.2: C35.1 R8.1
N$15
  Bottom 0.2: C36.2 24.4,49.6 R31.2
N$16
  Bottom 0.2: U15.7 71.05,26.65 72.4,28 R13.1
N$17
  Top 0.2: 27.6,17.2 26.6,17.2
N$18
  Top 0.2: R40.1 42,42.6 43.33,43.93 LED1.K
N$19
  Top 0.2: U6.4 24.7,49.7 24.2,49.2 24.2,45.67 25.68,44.2 25.68,43.88 25.8,43.8 R5.1
N$20
  Bottom 0.2: 52.6,30.4 53.2,30.4
N$21  (via drill 0.4)
  Top 0.4: C34.2 27.68,48.47 v27.4,48.4 27.57,48.44 U6.3
  Bottom 0.4: JP5.2 27.2,48.2 v27.4,48.4
N$22  (via drill 0.5)
  Top 0.6: JP10.1 EX1.P$1
  other vias: 9.65,0.79
N$23  (via drill 0.5)
  Top 0.4: JP10.2 10.92,4.6 EX2.P$1
  other vias: 10.92,0.79
N$25  (via drill 0.5)
  Top 0.2: JP10.4 13.46,4.6 EX4.P$1
  other vias: 13.46,0.79
N$26
  Top 0.2: 31,14.8 31,16 31.3,16.3 U11.6 | C32.1 32.34,14.66 32.3,14.8 31,14.8 | 31,14.8 30.45,14.8 Q10.1
N$27  (via drill 0.5)
  Top 0.2: JP10.5 EX5.P$1
  other vias: 14.73,0.79
N$28
  Top 0.2: 24.34,21.3 24.46,21.3 | 24.46,21.3 U11.60 | 24.34,21.3 R25.2 24.46,21.3 | JP7.1 22.25,20.85 22.7,21.3 24.34,21.3
N$29
  Top 0.2: 21.24,41.48 U8.3
  Top 0.25: R9.1 23,41.6 22.88,41.48 21.24,41.48 | R9.1 R10.1 | R9.1 C14.1
N$30  (via drill 0.5)
  Top 0.2: JP10.6 16,4.6 EX6.P$1
  other vias: 16,0.79
N$31  (via drill 0.5)
  Top 0.2: JP10.7 EX7.P$1
  other vias: 17.27,0.79
N$32  (via drill 0.5)
  Top 0.2: JP10.8 18.54,4.6 EX8.P$1
  other vias: 18.54,0.79
N$33  (via drill 0.5)
  Top 0.2: JP10.9 EX9.P$1
  other vias: 19.81,0.79
N$34  (via drill 0.5)
  Top 0.2: JP10.10 21.08,4.6 EX10.P$1
  other vias: 21.08,0.79
N$35
  Bottom 0.2: ANT1.A ANT3.1 | D3.1 74.2,20.1 74.2,20.3
  Bottom 0.4: 73.2,20.1 C50.1 73.5,20.3 | 73.2,20.1 73.2,21 | 73.2,21 73.2,21.65 L3.2 | 73.2,20.1 73.4,20.2 | 73.8,20.2 73.8,20.4 73.2,21
  Bottom 0.6: 77.75,20.35 arc-90 ANT1.A | 73.4,20.2 73.8,20.2
  Bottom 0.8: 73.5,20.3 74.2,20.3 ANT1.A
N$36  (via drill 0.5)
  Top 0.2: JP10.11 EX11.P$1
  other vias: 22.35,0.79
N$37  (via drill 0.5)
  Top 0.2: JP10.12 23.62,4.6 EX12.P$1
  other vias: 23.62,0.79
N$38
  Top 0.2: R49.2 45.2,48 46.65,48 SW1.2
N$43
  Bottom 0.3: R11.2 28,36.6 27.74,36.34 27.74,35 27.7,35 Q7.3
  Bottom 0.6: Q7.3 26.8,34.1 26.8,33.2 26.2,32.6 Q6.3
N$51
  Top 0.2: C43.1 1,24.6 0.8,24.4 0.8,22.91 | 0.8,22.91 Q5.4 | 0.8,22.91 0.8,21 1.8,20 5.8,20 6.6,20.8 R28.2 6.67,22 R29.2
N$52  (via drill 0.4)
  Top 0.2: v37.2,49.1 37.1,49 36.08,49 U$4.3
  Bottom 0.2: X2.D- 34,46 37.1,49.1 v37.2,49.1
N$53  (via drill 0.4)
  Top 0.2: v37.2,47.6 36.08,47.6 U$4.1
  Bottom 0.2: X2.D+ 34.8,46 36.4,47.6 v37.2,47.6
N$54
  Top 0.2: U11.5 30.8,16.4 30.4,16 29.4,16 28.4,15 28.4,14.5 27.1,13.2 26.45,13.2 Q10.3 26.2,12.75 26.6,12.8 26.24,12.6 24.6,12.6 C33.2
N$999
  Top 0.2: U$3.1 30.35,47.35 29.6,46.6 29.6,45.65 R17.1 29.6,45.6 29.6,44.05 R18.2
PA0.GSM-READY  (via drill 0.4)
  Top 0.2: U11.14 35.3,16 36,15.3 37.7,15.3 42,19.6 v42.3,19.6 | U14.43 57.1,40.7 57,40.6 57,38 54.2,35.2 54.2,28.8 54.4,28.6 54.4,25.2 53.8,24.6 52.6,24.6 | v47,30.2 48.6,30.2 50.4,28.4 50.4,27.2 52,25.6 52,25 52.4,24.6 | 52.4,24.6 52.6,24.6 | v52.4,21.4 52.4,24.4 | 52.4,24.4 52.4,24.6 | 52.4,24.4 52.6,24.6
  Bottom 0.2: v52.4,21.4 44.5,21.4 42.7,19.6 v42.3,19.6 | R15.2 45,29.4 45,30.1 45.3,30.4 46.15,30.4 R16.1 46.2,30.4 47,30.4 | R14.2 47.45,30.4 47,30.4 | 47,30.4 v47,30.2
PA1
  Top 0.2: U11.15 35.8,16.1 36.1,15.8 37,15.8 PA1.TP
PA2-USART2-TX  (via drill 0.4, 0.6)
  Top 0.2: U11.16 36.3,17.3 PA2A.TP
  Bottom 0.2: PA2A.TP 37.6,17.2 37.6,10.4 37.8,10.4 37.8,10.7 PA2.TP
  other vias: 37.8,17.3 37.76,10.6
PA3-USART2-RX  (via drill 0.4, 0.6)
  Top 0.2: PA3A.TP 39.4,19.3 U11.17
  Bottom 0.2: PA3A.TP 39.4,18.7 39.4,17.5 38,16.1 38,11.6 39,10.6 PA3.TP
  other vias: 39.03,10.6 39.7,19
PA4.SD-!CS  (via drill 0.4, 0.6)
  Top 0.2: U11.20 37.5,20.8 36.2,19.5 35,19.5 v34.3,18.8
  Bottom 0.2: v31.41,10.6 31.6,10.4 31.6,12 33.9,14.3 33.9,18.4 v34.3,18.8
  Bottom 0.5: U3.CSN v31.41,10.6
PA5.SD-CLK  (via drill 0.4, 0.6)
  Top 0.2: U11.21 37.4,21.3 36.1,20 v34.3,20
  Bottom 0.2: v34.3,20 35.2,19.1 35.2,13.3 33.8,11.9 33,11.9 32.8,11.7 32.8,10.68 v32.68,10.6
  Bottom 0.4: U3.SCK v32.68,10.6
PA6.SD-DO  (via drill 0.4, 0.6)
  Top 0.2: U11.22 36.8,21.8 v36.3,21.3
  Bottom 0.2: v35.22,10.6 35.22,10.78 35.4,11 35.4,12.3 36,12.9 36,21 v36.3,21.3
  Bottom 0.4: U3.MISO v35.22,10.6
PA7.SD-DI  (via drill 0.4, 0.6)
  Top 0.2: v35.1,20.9 35.1,21.2 36.2,22.3 U11.23
  Bottom 0.2: U3.MOSI 33.95,10.65 34.2,10.8 34.2,11.7 35.6,13.1 35.6,20.4 v35.1,20.9
  Bottom 0.4: U3.MOSI v33.95,10.6
PA8.RTS  (via drill 0.4)
  Top 0.2: U11.41 32.3,29.6 32.6,29.9 33.3,29.9 34.8,31.4 39.35,31.4 v39.6,31.45 | U14.5 47.2,33.2 45.3,31.3 45.3,31.09 RTS-CTS.2 44.09,31.1 GSM-RTS.TP
  Bottom 0.2: v39.6,31.45 39.6,31.4 40,31 43.6,31 GSM-RTS.TP 43.45,30.45 R15.1
  other vias: 43.8,30.8
PA9.GPS-RXD  (via drill 0.4)
  Top 0.2: U11.42 31.8,29.7 32.4,30.3 33.1,30.3 34.6,31.8 37.7,31.8 38.1,32.2 40.9,32.2 43.3,34.6 GPS-RXD.TP
  Bottom 0.2: GPS-RXD.TP 44,34.5 49.9,34.5 52.8,31.6 54,31.6 54.8,30.8 55,30.8 JP2.2
  other vias: 43.3,35.2
PA10.GPS-TXD  (via drill 0.4)
  Top 0.2: GPS-TXD.TP 41.6,33.8 40.4,32.6 37.9,32.6 37.5,32.2 34.4,32.2 32.9,30.7 32.2,30.7 31.3,29.8 U11.43
  Bottom 0.2: GPS-TXD.TP 49.7,34.1 52.4,31.4 JP6.2
  other vias: 41.6,34.1
PA15.!CAN-EN  (via drill 0.4)
  Top 0.2: R33.2 20.26,45.06 20.4,45.2 20.4,45.89 U6.8 21.08,45.8 23.4,45.8 24.8,44.4 24.8,43.8 29.6,39 29.6,38.1 31.7,36 PA15.TP | U11.50 28.85,26.3 v29.1,26.55
  Bottom 0.2: PA15.TP 32.9,34 32.9,30.8 29.1,27.1 v29.1,26.55
  other vias: 31.7,35.1
PB0-GPS-PWR  (via drill 0.4)
  Top 0.2: v53.2,25.8 52,27 52,32.6 51.8,32.8 51.8,37.2 v52,37.4 | U11.26 v43.1,23.8
  Bottom 0.2: v43.1,23.8 43.4,23.8 43.8,23.4 50.8,23.4 v53.2,25.8 | U9.3 52.1,36.7 52,36.8 v52,37.4 52,38.4 R12.1
PB1.VBAT-SENS
  Top 0.2: 42.74,25.4 42.6,25 41.9,24.3 U11.27 | 42.74,25.4 C47.2 | 42.74,25.4 42.6,25.4 42.6,26.9 R51.2 42.74,27 42.7,27.2 R50.1
PB2.CTS/BOOT1
  Top 0.2: 43.94,29.2 R24.1 | 43.94,29.2 42.15,29.2 41.85,28.9 41.85,26.45 40.2,24.8 U11.28 | RTS-CTS.1 44.69,29.95 43.94,29.2 | RTS-CTS.1 45.75,30.15 45.9,30.3 45.9,30.5 47,31.6 47.55,31.6 U14.6 | RTS-CTS.1 GSM-CTS.TP
PB3/SWD/GSM-RESET  (via drill 0.4)
  Top 0.2: v33.5,25.7 33.1,25.3 33.1,24.2 32.4,23.5 28.1,23.5 27.8,23.8 U11.55 25.6,23.8 SWO.TP
  Bottom 0.2: v33.5,25.7 33.7,25.9 39.6,25.9 42.3,28.6 44.1,28.6 44.3,28.8 44.3,30.1 46,31.8 GSM-RESET.1
  other vias: 25.1,24.3
PB4  (via drill 0.4)
  Top 0.2: U11.56 25.9,23.3 25.8,23.4 23.8,23.4 PB4.P$1
  other vias: 23.2,24
PB5.GSM-PWR  (via drill 0.4)
  Top 0.2: U11.57 29.7,22.8 30,23.1 32,23.1 v32.4,22.7 | v53.2,27.8 53.4,28 53.4,36.2 v55.4,38.2
  Bottom 0.2: v32.4,22.7 33.8,22.7 35.4,24.3 40.5,24.3 43.2,27 48.8,27 49.8,28 53,28 v53.2,27.8 | v55.4,38.2 56.2,39 57.6,39 R3.2
PB6.RELAY-ON  (via drill 0.4)
  Top 0.2: U11.58 25.6,22.3 v25.3,22.6 | R29.1 v10.2,22
  Bottom 0.2: v10.2,22 13.2,19 24.8,19 25.4,19.6 25.4,22.5 v25.3,22.6
PB7.VDC_P
  Top 0.2: U11.59 23.4,21.8 21.6,23.6 21.6,25.6 | R48.2 21.6,25.6 | 21.6,25.6 R47.1
PB8.CAN-RX  (via drill 0.4)
  Top 0.2: v33.3,35.4 32.9,35.4 30,38.3 30,39.2 28.2,41 28.2,41.55 R6.2 28.05,41.95 27.4,42.6 27.4,44 R5.2 | U11.61 28.6,20.8 v28.7,20.9
  Bottom 0.2: v33.3,35.4 33.7,35 33.7,30.4 30.3,27 30.3,23.7 29,22.4 29,21.2 v28.7,20.9
PB9.CAN-TX  (via drill 0.4)
  Top 0.2: U11.62 28.1,20.3 28.3,20.1 29.1,20.1 29.8,20.8 v29.8,21.4 | v33.4,36.5 32.4,36.5 30.4,38.5 30.4,42.4 29.8,43 29.3,43 28.6,43.7 28.6,44.8 27.5,45.89 U6.1
  Bottom 0.2: v29.8,21.4 29.8,22.6 30.7,23.5 30.7,26.8 34.1,30.2 34.1,35.8 v33.4,36.5
PB10.ACC-SCL  (via drill 0.4)
  Top 0.2: 55.7,45.2 54.6,44.1 51.1,44.1 49.8,42.8 48.5,42.8 45.8,40.1 45.8,34.7 41.45,30.35 41.45,26.65 40.1,25.3 U11.29 | 55.7,45.2 55.8,45.3 55.8,48 55.6,48.2 U5.14 | 55.7,45.2 v55.8,45.2 60,45.2 61.25,46.45 U17.1
  Bottom 0.2: v55.8,45.2 R46.1
PB11.ACC-SDA  (via drill 0.4)
  Top 0.2: U11.30 40,25.8 41.05,26.85 41.05,30.55 45.4,34.9 45.4,40.3 48.3,43.2 49.6,43.2 50.9,44.5 54.4,44.5 54.8,44.9 | 54.8,44.9 U5.13 | 54.8,44.9 54.5,44.9 v54.3,45.1 | U17.3 62.65,48.35 v62.6,48.6
  Bottom 0.2: v54.3,45.1 54.3,46.1 54.34,46.14 R30.2 54.36,46.4 54.4,46.4 55,47 57.4,47 58,47.6 61.4,47.6 62.4,48.6 v62.6,48.6
PB12.ACC-INT2
  Top 0.2: U11.33 36.3,29.4 37,29.4 37.9,30.3 40.2,30.3 45,35.1 45,40.5 48.1,43.6 49.4,43.6 51.6,45.8 U5.9
PB13.ACC-INT1
  Top 0.2: U11.34 35.8,29.5 36.1,29.8 36.8,29.8 37.7,30.7 40,30.7 44.6,35.3 44.6,40.7 47.9,44 49.2,44 50.8,45.6 U5.8
PB14.LED  (via drill 0.4)
  Top 0.2: U10.3 29.25,37.15 30.5,35.9 30.5,35.1 31.3,34.3 32.9,34.3 33.2,34.6 34.9,34.6 v35.3,35 | U11.35 v35.3,30.2 | R40.2 42,40.2 42.6,39.6 v42.6,38.4
  Bottom 0.2: v35.3,30.2 35.1,30.4 35.1,34.8 v35.3,35 35.3,35.2 36.9,36.8 40.6,36.8 42.2,38.4 v42.6,38.4
PB15.KEY  (via drill 0.4)
  Top 0.2: U11.36 34.8,29.6 34.5,29.9 34.5,30.5 35,31 36,31 v36.4,30.6 | v29,33.9 33.1,33.9 33.4,34.2 36,34.2 v36.4,34.6 | v41.9,36.9 42.3,36.9 43.4,38 43.4,41.7 44.6,42.9 44.6,45.2 42.7,47.1 42.7,47.85 SW1.1
  Bottom 0.2: v29,33.9 28.85,34.05 U1.1 28.85,35.55 29.4,36.1 29.4,37.4 30,38 30,38.06 R45.2 | v36.4,30.6 36.1,30.9 36.1,34.3 v36.4,34.6 36.4,35.7 37.1,36.4 41.4,36.4 v41.9,36.9
PC0.SENS-D1  (via drill 0.4)
  Top 0.2: D4.3 16.4,24.8 16.4,25.2 | 16.4,25.2 16.4,26.6 | v32.3,19.1 U11.8 | v18.5,17.3 18.8,17.6 18.8,24.6 18.2,25.2 16.4,25.2 | C13.1 16.4,26.6 | R27.2 15.8,28.2 16.4,27.6 16.4,26.6
  Bottom 0.2: v32.3,19.1 32.3,19.2 31.5,20 30.8,20 27.8,17 24,17 23.2,17.8 19,17.8 v18.5,17.3
PC2.SENS-A1  (via drill 0.4)
  Top 0.2: U11.10 33.3,18.4 33.1,18.6 33.1,19.7 32.5,20.3 v32.3,20.3 | C40.1 16.4,22.6 16.4,21.8 | 16.4,21.8 16.4,21.05 R41.2 16.4,20.95 16.4,19.4 | R42.2 16.4,21.8 | D14.3 16.4,19.4 | 16.4,19.4 16.4,18.4 v17,17.8
  Bottom 0.2: v32.3,20.3 32.2,20.4 30.6,20.4 27.6,17.4 24.4,17.4 23.6,18.2 17.4,18.2 v17,17.8
PC4.SD-PWR  (via drill 0.4)
  Top 0.2: v41.9,22.6 41.7,22.8 U11.24 | 60.35,12.6 U7.3 60,12.6 59,13.6 58.2,13.6 v57.6,14.2 R7.1
  Bottom 0.2: v41.9,22.6 53,22.6 55.8,19.8 55.8,16 v57.6,14.2
PC6  (via drill 0.4, 0.6)
  Top 0.2: U11.37 34.3,27.7 35.2,26.8 35.2,23.2 35.5,22.9 35.5,22.2 35,21.7 33.7,21.7 v33.5,21.5
  Bottom 0.2: U3.CE v30.14,10.6 30.14,10.54 30.4,10.8 30.4,11.4 33.5,14.5 v33.5,21.5
PC7  (via drill 0.4, 0.6)
  Top 0.2: v34.7,22.5 34.8,26.6 33.8,27.6 U11.38
  Bottom 0.2: U3.IRQ 36.49,10.51 36.4,10.6 36.4,17.6 37.1,18.3 37.1,22.2 36.6,22.7 34.9,22.7 v34.7,22.5
  Bottom 0.4: U3.IRQ v36.49,10.6
PC9.GSM-DTR  (via drill 0.4)
  Top 0.2: U11.40 32.8,28 34.3,26.5 34.3,24.3 v33.7,23.7 | 47.5,34.6 U14.4 | 47.5,34.6 48.6,34.6 49.4,33.8 49.4,31 v50,30.4 | 47.5,34.6 46.7,34.6 GSM-DTR.TP
  Bottom 0.2: v33.7,23.7 34.2,23.7 35.2,24.7 40.25,24.7 42.95,27.4 48.6,27.4 49.4,28.2 49.4,30.4 | R14.1 49.15,30.4 49.4,30.4 | 49.4,30.4 v50,30.4
PC10.GSM-TXD(I)  (via drill 0.4)
  Top 0.2: U11.51 32.2,25.8 v32.3,25.7 | v46.9,28.6 46.9,27.3 47.4,27.2 47.7,27.2 U14.7 GSM-TXD.TP
  Bottom 0.2: v32.3,25.7 33.1,24.9 34.2,24.9 34.8,25.5 39.8,25.5 42.5,28.2 46.5,28.2 v46.9,28.6 46.7,28.8 46.2,28.8 R16.2
PC11.GSM-RXD(O)  (via drill 0.4)
  Top 0.2: U11.52 27.8,25.3 27.9,25.4 31.4,25.4 v32.3,24.5 | v48.5,28.6 49.4,27.7 49.4,26.6 48.2,25.6 U14.8 46,25.6 GSM-RXD.TP
  Bottom 0.2: v32.3,24.5 34.4,24.5 35,25.1 40,25.1 42.7,27.8 47.7,27.8 v48.5,28.6
PC12.USB_DISC  (via drill 0.4)
  Top 0.2: U11.53 27.9,24.8 28.1,25 29.15,25 v29.5,24.65 | R18.1 31.2,44 31.2,40.1 32.5,38.8 v32.5,38.6
  Bottom 0.2: v29.5,24.65 29.9,25.05 29.9,27.2 33.3,30.6 33.3,34.2 32.5,35 v32.5,38.6
PC13.USB_P  (via drill 0.4)
  Top 0.2: R20.2 R21.1 v34,38.7 | U11.2 29.3,19.7 30.7,21.1 30.7,21.7 v30.9,21.9
  Bottom 0.2: v34,38.7 34.3,38.7 34.8,38.2 34.8,36.1 34.5,35.8 34.5,30 31.1,26.6 31.1,23.3 30.7,22.9 30.7,22.1 v30.9,21.9
PD2.CPU_PWR  (via drill 0.4)
  Top 0.2: U11.54 28.5,24.3 v28.45,24.25
  Bottom 0.2: v28.45,24.25 28.2,24.5 28.2,26.8 32.5,31.1 32.5,33.2 32,33.7 30.2,33.7 29.9,34 29.9,34.95 U1.2 29.85,35.15 29.9,35.2 29.9,36.56 R23.1
PWR-VCC  (via drill 0.4)
  Top 0.2: v43.4,36.8 43.8,37.2 43.8,41.4 45.4,43 45.4,44 | 45.4,44 45.4,45.7 45,46.1 R49.1 | v28.2,32.4 28.8,32.4 29.9,33.5 33.3,33.5 33.6,33.8 36.7,33.8 37.2,34.3 v37.2,35.4 | LED1.A 45.77,44 45.4,44
  Top 0.3: D10.3 26.9,32.4 v28.2,32.4
  Bottom 0.2: v37.2,35.4 37.8,36 42.2,36 43,36.8 v43.4,36.8 | 28.8,32.55 28.65,32.4 v28.2,32.4 | R22.1 28.74,31.16 28.8,31.3 28.8,32.55 | U1.5 28.8,32.55
RELAY
  Top 1: X1.8 7.28,31.88 5.8,30.4 4.05,30.4 F1.2
RESET  (via drill 0.4)
  Top 0.2: U11.7 31.8,18.5 v31.1,19.2 | R43.1 v23.4,16.2 C42.1 23.36,15.4 22,15.4 RESET.TP
  Bottom 0.2: v31.1,19.2 30.6,19.2 28,16.6 23.8,16.6 v23.4,16.2
  other vias: 21.2,14.6
SD-VCC  (via drill 0.4, 0.6)
  Top 0.4: v39.3,12.3 39.2,12.3 38.5,11.6 29.06,11.6 29.06,11.26 29,11.2 | v28.87,10.6 29,10.6 29,11.2 | U7.5 C9.1 C10.1 53.2,10.85 v53.2,10.9 | C41.2 29,11.2
  Bottom 0.4: v53.2,10.9 53.2,10.7 45.1,10.7 43.5,12.3 v39.3,12.3 | 28.96,10.66 28.8,10.6 v28.87,10.6 28.86,10.36 U3.VDD 29,10.93
SENS-VCC
  Top 0.25: R26.2 15.2,26.75 15.2,25.6 14.7,25.1 14.7,24.2 13.75,23.25 D4.2 12.85,23.25 12,22.4 12,20 13.55,18.45 D14.2 | D14.2 13.75,18.4 13.8,18.4 | R4.1 13.8,17 13.8,18.35 D14.2
SIMCLK  (via drill 0.4)
  Top 0.2: U14.11 47.65,20.9 46.7,20.9 46,20.2 46,19.1 47.7,17.4 47.7,15.8 | U2.6 43.53,17.44 44.1,18 45.5,18 45.9,17.6 45.9,15.9 46.2,15.6 47.5,15.6 | 47.5,15.6 47.7,15.8 | 47.7,15.8 47.9,15.6 | 47.9,15.6 v48.8,15.6 48.8,14.8 48.9,14.7 C3.2 | 47.5,15.6 47.9,15.6
  Bottom 0.2: U4.3 49.58,14.82 v48.8,15.6
SIMIO  (via drill 0.4)
  Top 0.2: U14.12 50.8,19.6 51.1,19.9 | v50.4,25.2 51,24.6 51,20 51.1,19.9 | v51,19.9 51.1,19.9 | v51.8,12 50.4,12 JS4.2
  Bottom 0.2: 49.8,25.2 49.6,25.32 U4.6 | v51.8,12 51.8,19 51,19.8 v51,19.9 | C2.1 50.2,26.8 49.8,26.4 49.8,25.2 | 49.8,25.2 v50.4,25.2
SIMRST  (via drill 0.4)
  Top 0.2: U14.10 47.6,22.6 47.4,22.4 46.7,22.4 45.6,21.3 45.6,18.6 | 45.6,18.6 45.4,18.4 | 45.4,18.4 43.5,18.4 42.4,17.3 42.4,17 U2.7 | 45.8,18.4 46.8,17.4 v46.8,17.2 C18.2 | 45.8,18.4 45.6,18.6 | 45.4,18.4 45.8,18.4
  Bottom 0.2: U4.2 46.8,15.04 v46.8,17.2
SIMVCC  (via drill 0.4)
  Top 0.2: U2.8 40.9,17 42.1,18.2 42.7,18.2 43.3,18.8 44.4,18.8 v44.8,19.2 | C4.2 45.1,22.5
  Top 0.3: U14.9 46.7,24.1 45.1,22.5 45.1,19.5 v44.8,19.2
  Bottom 0.2: U4.1 44.8,14.8
  Bottom 0.3: 44.7,14.7 44.6,14.6 U4.1 | 44.8,14.8 v44.8,19.2
SWCLK  (via drill 0.4)
  Top 0.2: R38.2 22.8,27.2 SWCLK.TP 25,26.8 U11.49
  other vias: 24.6,27.2
SWD
  Top 0.2: U11.46 29.8,30.9 SWDIO.TP
VBAT  (via drill 0.4)
  Top 0.2: 26,31.6 28.6,31.6 30.1,33.1 33.5,33.1 33.8,33.4 36.9,33.4 37.7,34.2 v38.2,34.2 | v44.6,32.3 44,32.3 42.7,31 R50.2
  Top 0.3: D10.2 25.55,31.65 26,31.6
  Top 0.4: U10.5 25.85,35.25 26,35.2 26,31.6 24.8,31.6 24.4,31.2 24.4,30.1 v24.3,30
  Bottom 0.2: v38.2,34.2 38.2,34.3 39,35.1 39.9,35.1 40.4,34.6 40.4,33.1 40.9,32.6 44.3,32.6 v44.6,32.3
  Bottom 0.3: JP18.1 20.88,25.88 21.2,26.2 JP3.2 | 22,30 C37.2 | R36.2 25.14,28.84 25.2,28.9 25.2,30.15 Q6.2 | 25.15,30 Q6.2 | Q6.2 25.35,30.2 25.2,30.2 v24.3,30
  Bottom 0.8: 25.15,30 22,30 21.2,29.2 JP3.2
VDC-4.5V  (via drill 0.4)
  Top 0.3: 24.6,36.6 v24.4,36.8 | 24.65,33.6 24.6,33.6
  Top 0.4: 24.6,33.6 24.6,36.6 | D10.1 24.65,33.6
  Bottom 0.3: 23.8,35.8 R34.2 23.86,35.66 | 21.45,35.8 D11.C
  Bottom 0.4: 23.8,35.8 21.45,35.8 | 23.86,35.66 24,35.8 24,36.4 v24.4,36.8
  Bottom 0.6: 22,34.4 JP9.2 | JP8.1 23.6,38.4
  Bottom 0.8: D11.C 21.7,35.95 | 21.7,38.6 D7.A 23.6,38.4 | 21.45,35.8 21.6,35.8 22,35.4 22,34.4
  Bottom 1: 21.7,35.95 21.7,38.6
VDC-5V  (via drill 0.4, 0.6)
  Top 0.2: 21.4,31.45 21.55,31.6 C15.2 21.8,30.8 | R47.2 19.8,25.6 | C53.2 21.4,10.5
  Top 0.25: C14.2 24.14,39.94 v24,40 | R9.2 23.66,39.94 v24,40 | 23.24,39.94 v24,40 | C52.2 21.4,28.2
  Top 0.3: 21.7,31.4 v21.2,31.6 | 23.4,32.8 23.45,32.95
  Top 0.4: 21.6,31.4 21.4,31.4 | 21.4,31.4 v21.2,31.6 | 22,31.4 23.4,32.8 23.4,37.6 | 23.4,37.6 23.4,37.9 | 21.4,31.45 21.4,31.4 | 21.4,31.4 21.4,28.2 21.4,27.8 19.8,26.2 19.8,25.6 19.8,11.4 20.7,10.5 21.4,10.5 25,10.5 25.06,10.44 v25.06,10.6 | 23.4,37.9 24,38.5 | 24,38.55 v24,40 | U10.4 25.35,37.15 24.5,38 | 24.5,38 24,38.5 | 24,38.5 24,38.55 | 24,38.55 C44.2 24,38.5 | 23.4,37.9 23.8,38 | 23.8,38 24,38 | 24,38 24.5,38 | 24,38 24,38.4 | 23.4,37.6 23.8,38
  Top 0.5: 21.7,31.4 22,31.4
  Top 0.8: C15.2 21.6,31.4 21.7,31.4 | L1.P$2 16.8,31.6 16.8,31.8 17.2,31.4 21.4,31.4 | 21.8,30.8 17.6,30.8
  Bottom 0.3: D11.A 21.25,31.65 v21.2,31.6
  Bottom 0.4: JP5.1 26.21,46.21 25.41,45.41 25.41,42.21 24,40.8 v24,40
  Bottom 0.6: JP9.1 22,33
  Bottom 0.8: 22,33 22,32.25 D11.A
VDDA
  Top 0.2: C25.1 35.8,14.4
  Top 0.25: 34.8,14.4 U11.13 | 34.8,14.4 34.4,14.4 C26.2 | 34.8,14.4 35.8,14.4 37.3,14.4 37.3,14.2 BEAD1.1
VE
  Bottom 0.2: 27.2,29.8 29.4,29.8 30.26,30.66 R22.2 30.4,31.24 30.4,31.5 30.75,31.85 U1.4 | R36.1 26.7,28.9 27.2,29.4 27.2,29.8 | 27.2,29.8 27.2,29.95 Q6.1
  Bottom 0.3: Q6.1 27.15,29.95 27.2,29.8
VMAIN(4V)  (via drill 0.4)
  Top 0.2: U13.3 36.65,36.65 37.1,37.1 37.1,38.2 36.7,38.6 35.6,38.6 U13.1
  Top 0.4: C20.1 60.45,15.2 | 60.45,15.2 60.45,14.55 | v61.6,15.2 60.45,15.2 | C31.2 60.45,14.55 | 60.45,14.55 61.8,13.2 61.8,11.2 61.4,10.8 60.35,10.8 U7.1
  Top 0.5: 35.6,38.6 v35.6,39.3 35.45,39.3 C30.1 | v61.6,22 61.6,38 59.8,39.8 v59.8,42.2
  Bottom 0.2: 63.6,40.95 R1.2 | C46.+ 60.3,42.3 59.85,42
  Bottom 0.3: 26.2,38.25 D7.C
  Bottom 0.5: v61.6,22 v61.6,15.2 | U9.1 51.25,34.75 50.6,35.4 50.6,40.2
  Bottom 0.6: v35.6,39.3 35.6,40.2 | JP8.2 24.8,38.4
  Bottom 0.8: Q7.2 25.3,35.9 26.2,36.8 26.2,38.25 | Q1.2 63.6,40.95 62.55,42 59.85,42 v59.8,42.2 59.8,42 57.4,42 55.6,40.2 50.6,40.2 35.6,40.2 28.1,40.2 26.45,38.55 26.15,38.55 D7.C 24.8,38.4

## Text on the board
Reference: CTS (O) | RTS (I) | TXD (I) | DTR(I) | RXD (O) | RESET | SWCLK | VDC +5V | CPU +3.3V | GND | SD-VCC +3.3V | PC6 | PC7 | PA5.SD-CLK | PA7.SD-DI | PA6.SD-DO | PC8 | PA2-USART2-TX | PA3-USART2-RX | RESET | GND | SWDIO | RFM70/73